# EAGLE design UsbBatteryAnalyzer (EAGLE 7.1.0)
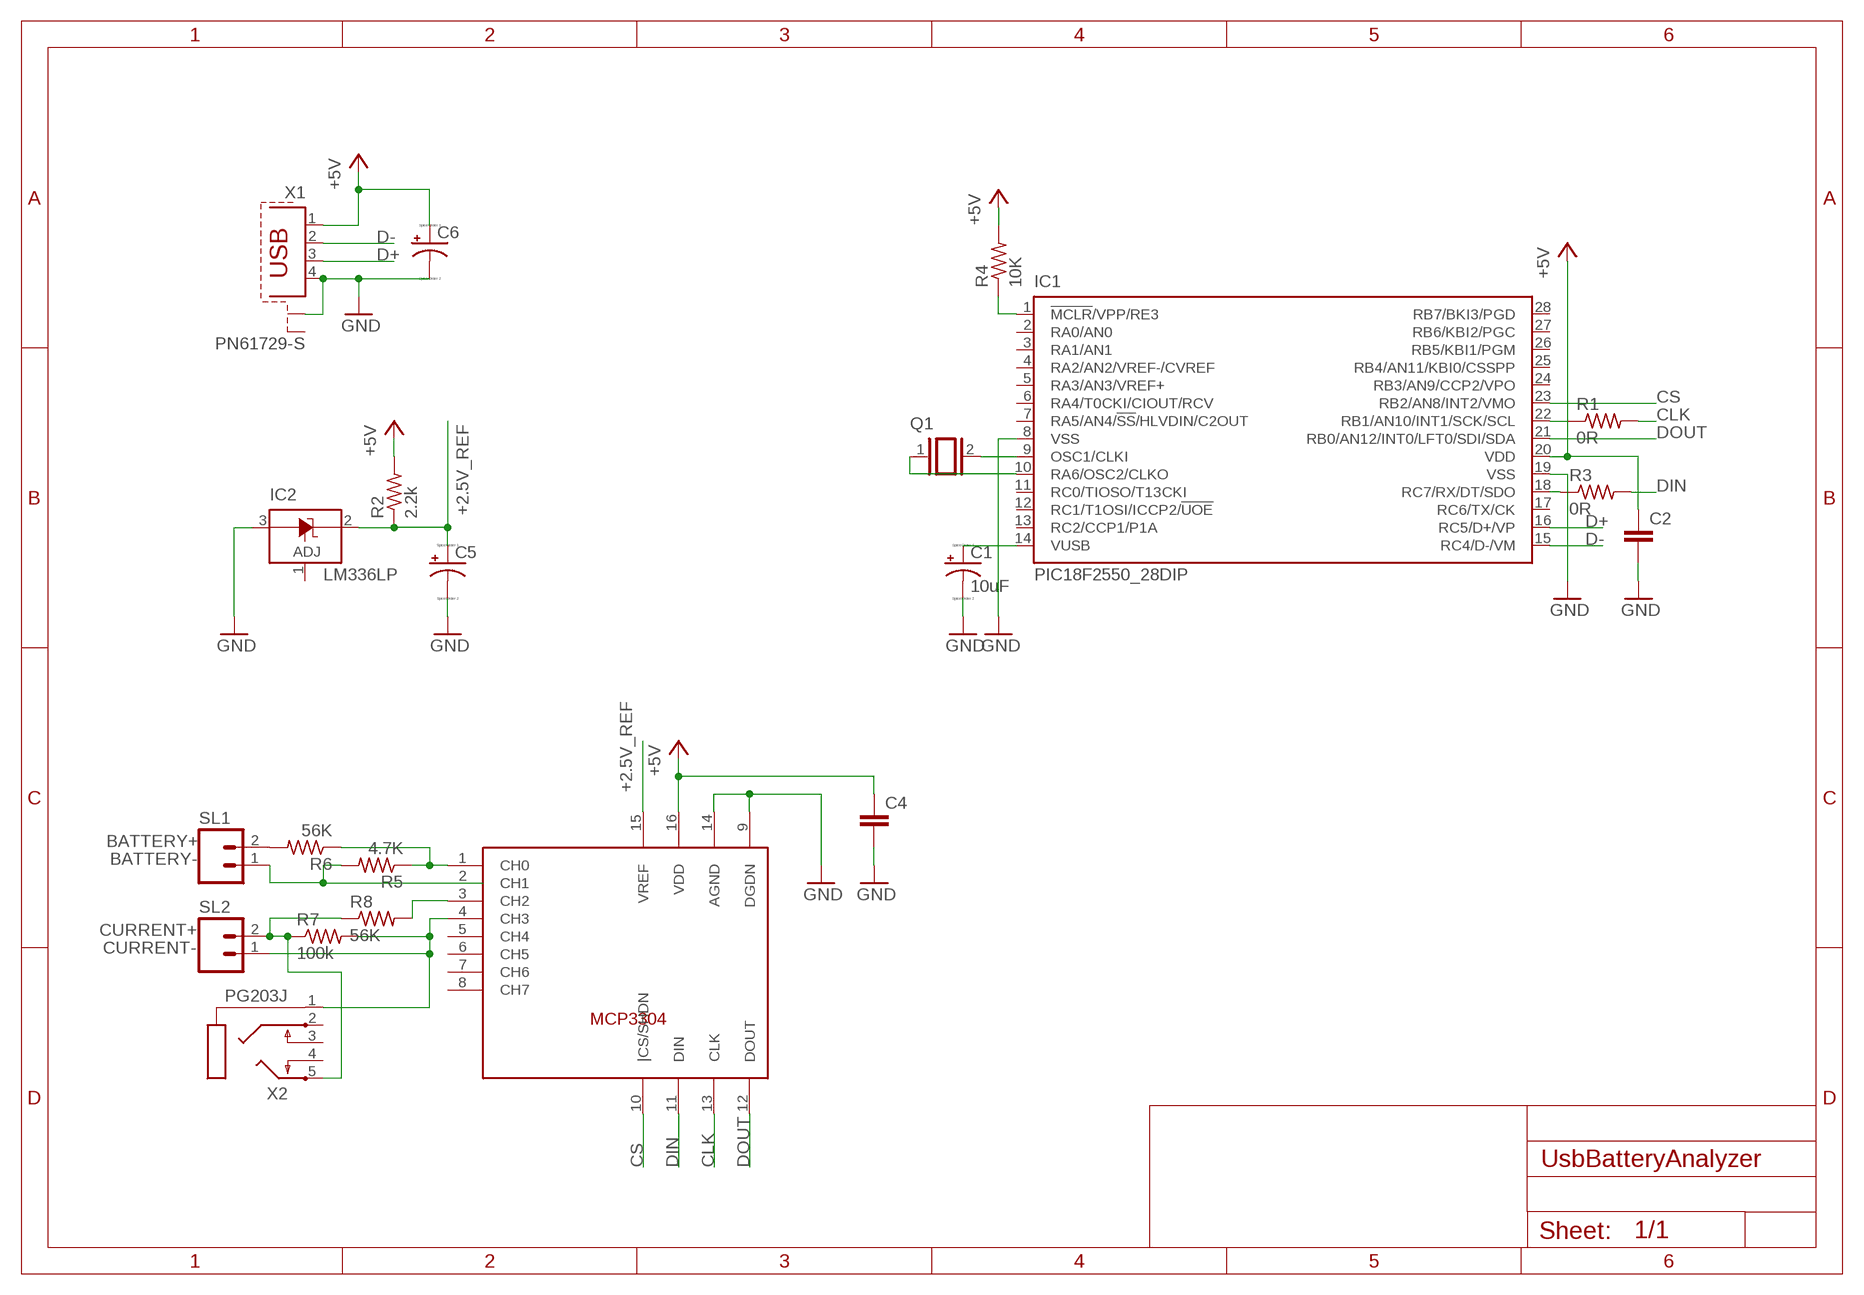
[diagram p0: schematic, sheet 1]

## Parts
C1  10uF  CPOL-USE2.5-7  [E2,5-7]
C2  C-EU050-024X044  [C050-024X044]
C4  C-EU050-024X044  [C050-024X044]
C5  CPOL-USE2.5-7  [E2,5-7]
C6  CPOL-USE2.5-7  [E2,5-7]
IC1  PIC18F2550_28DIP  [DIL28-3]
IC2  LM336LP  [TO92]
Q1  XTAL/S  [QS]
R1  0R  R-US_0207/5V  [0207/5V]
R2  2.2k  R-US_0204/7  [0204/7]
R3  0R  R-US_0207/10  [0207/10]
R4  10K  R-US_0204/7  [0204/7]
R5  4.7K  R-US_0204/7  [0204/7]
R6  56K  R-US_0204/7  [0204/7]
R7  100k  R-US_0204/7  [0204/7]
R8  56K  R-US_0204/7  [0204/7]
SL1  M02  [02P]
SL2  M02  [02P]
U$1  MCP3304  [DIP16]
X1  PN61729-S  [PN61729-S]
X2  PG203J  [PG203J]

## Nets
+2.5V_REF: C5.+ IC2.2(C) R2.1 U$1.15(VREF)
+5V: C2.1 C4.1 C6.+ IC1.20(VDD) R2.2 R4.2 U$1.16(VDD) X1.1
BATTERY+: R6.2 SL1.2
BATTERY-: R5.2 SL1.1 U$1.2(CH1)
CLK: R1.2 U$1.13(CLK)
CS: IC1.23(RB2/AN8/INT2/VMO) U$1.10(|CS/SHDN)
CURRENT+: R7.1 R8.1 SL2.2 X2.5
CURRENT-: R7.2 SL2.1 U$1.4(CH3) X2.1
D+: IC1.16(RC5/D+/VP) X1.3
D-: IC1.15(RC4/D-/VM) X1.2
DIN: R3.2 U$1.11(DIN)
DOUT: IC1.21(RB0/AN12/INT0/LFT0/SDI/SDA) U$1.12(DOUT)
GND: C1.- C2.2 C4.2 C5.- C6.- IC1.8(VSS) IC1.19(VSS) IC2.3(A) U$1.9(DGDN) U$1.14(AGND) X1.4 X1.S1
N$1: IC1.9(OSC1/CLKI) Q1.2
N$2: R5.1 R6.1 U$1.1(CH0)
N$3: IC1.10(RA6/OSC2/CLKO) Q1.1
N$4: C1.+ IC1.14(VUSB)
N$5: R8.2 U$1.3(CH2)
N$6: IC1.1(!MCLR!/VPP/RE3) R4.1
N$7: IC1.22(RB1/AN10/INT1/SCK/SCL) R1.1
N$8: IC1.18(RC7/RX/DT/SDO) R3.1
Unconnected: IC1.2(RA0/AN0) IC1.3(RA1/AN1) IC1.4(RA2/AN2/VREF-/CVREF) IC1.5(RA3/AN3/VREF+) IC1.6(RA4/T0CKI/CIOUT/RCV) IC1.7(RA5/AN4/!SS!/HLVDIN/C2OUT) IC1.11(RC0/TIOSO/T13CKI) IC1.12(RC1/T1OSI/ICCP2/!UOE) IC1.13(RC2/CCP1/P1A) IC1.17(RC6/TX/CK) IC1.24(RB3/AN9/CCP2/VPO) IC1.25(RB4/AN11/KBI0/CSSPP) IC1.26(RB5/KBI1/PGM) IC1.27(RB6/KBI2/PGC) IC1.28(RB7/BKI3/PGD) IC2.1(ADJ) U$1.5(CH4) U$1.6(CH5) U$1.7(CH6) U$1.8(CH7) X1.S2 X2.2 X2.3 X2.4

## Library data of the parts
C1 C5 C6 = resistor:CPOL-US: POLARIZED CAPACITOR, American symbol
C2 C4 = rcl:C-EU: CAPACITOR, European symbol
IC1 = microchip:PIC18F2*_28: USB Microcontrollers with nanoWatt Technology High-Performance, Enhanced Flash, 28/40/44-Pin, Source: http://ww1.microchip.com/downloads/en/devicedoc/39632c.pdf; MF: MICROCHIP; MPN: PIC18F2550-I/SP; OC_FARNELL: 1523822; OC_NEWARK: 80K6054
IC2 = linear:LM336: 2.5-V INTEGRATED REFERENCE CIRCUITS LM236 Source: http://focus.ti.com/lit/ds/symlink/lm336-2.5.pdf
Q1 = special:XTAL/S: CRYSTAL
R1-R5 R7 R8 = rcl:R-US_: RESISTOR, American symbol
R6 = resistor:R-US_: RESISTOR, American symbol
SL1 SL2 = con-amp-quick:M02: AMP QUICK CONNECTOR; OC_FARNELL: unknown; OC_NEWARK: unknown
U$1 = mcp3304:MCP3304: 8 channel ADC converter with SPI interface
X1 = con-berg:PN61729-S: BERG USB connector; OC_FARNELL: unknown; OC_NEWARK: unknown
X2 = con-hirschmann:PG203J: MIC/HEADPHONE JACK KS-S stereo microphone/headphone jack PG203JN (Schukat); OC_FARNELL: unknown; OC_NEWARK: unknown

## Board
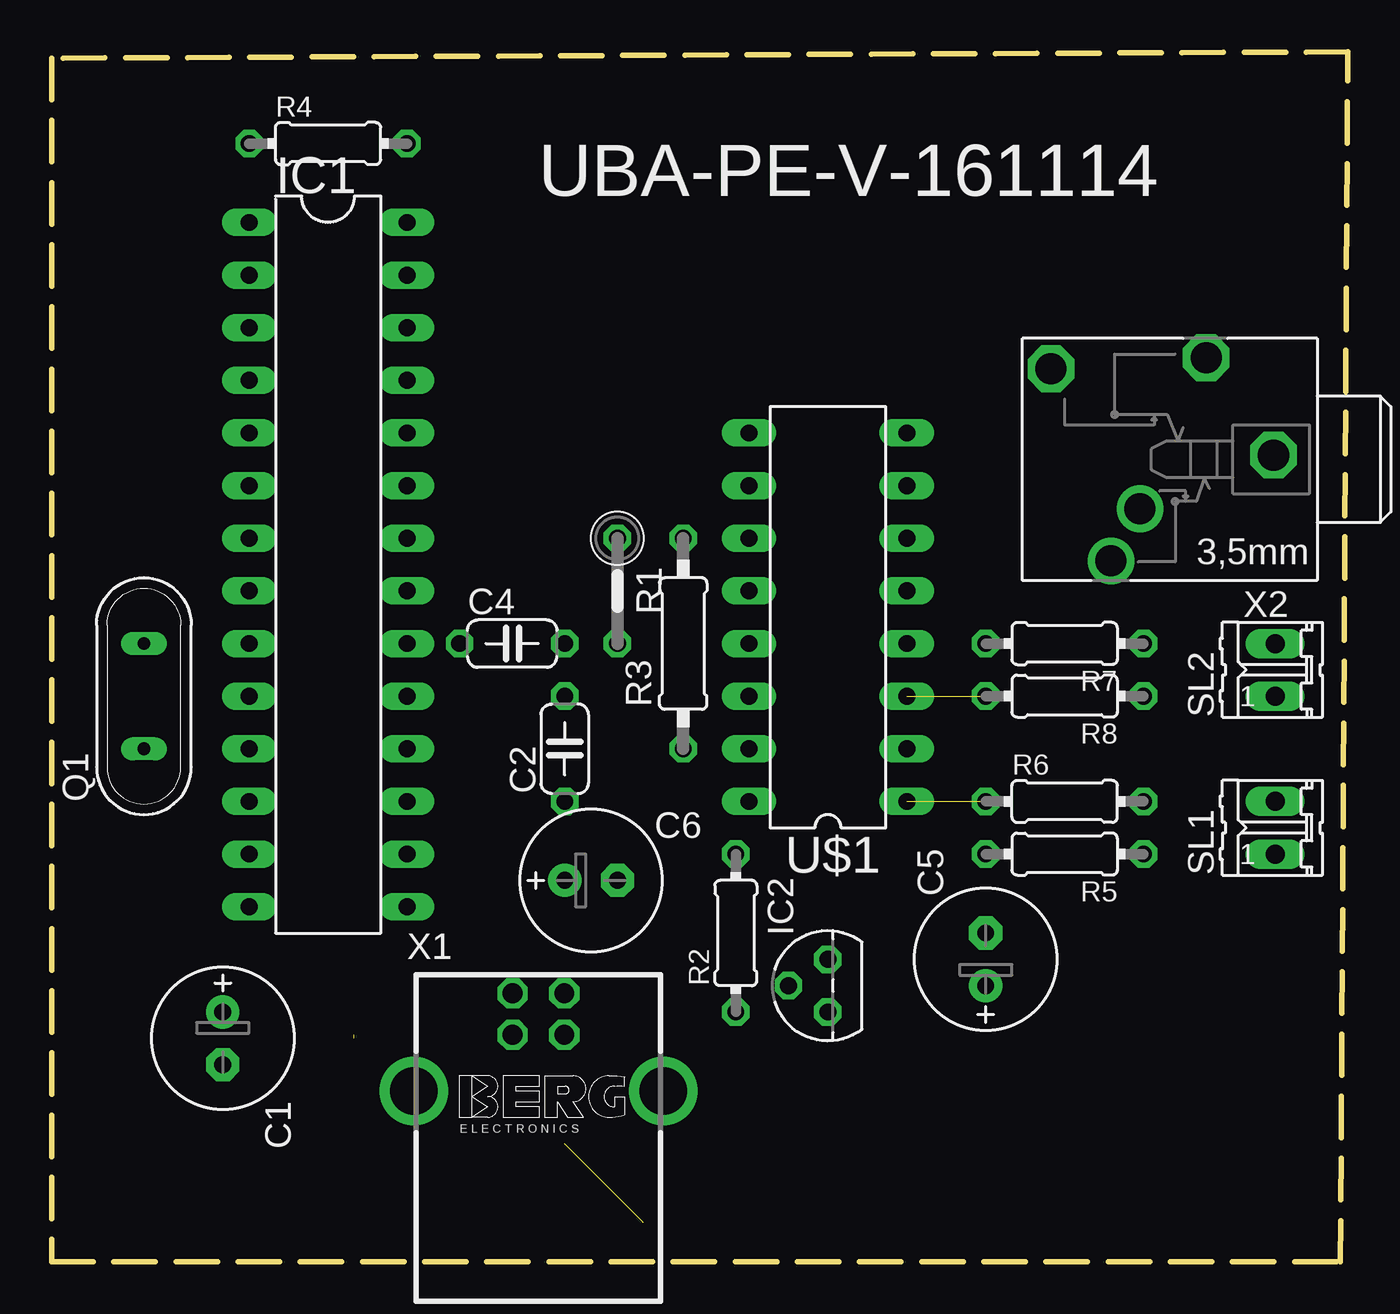
[diagram p1: board, top side]
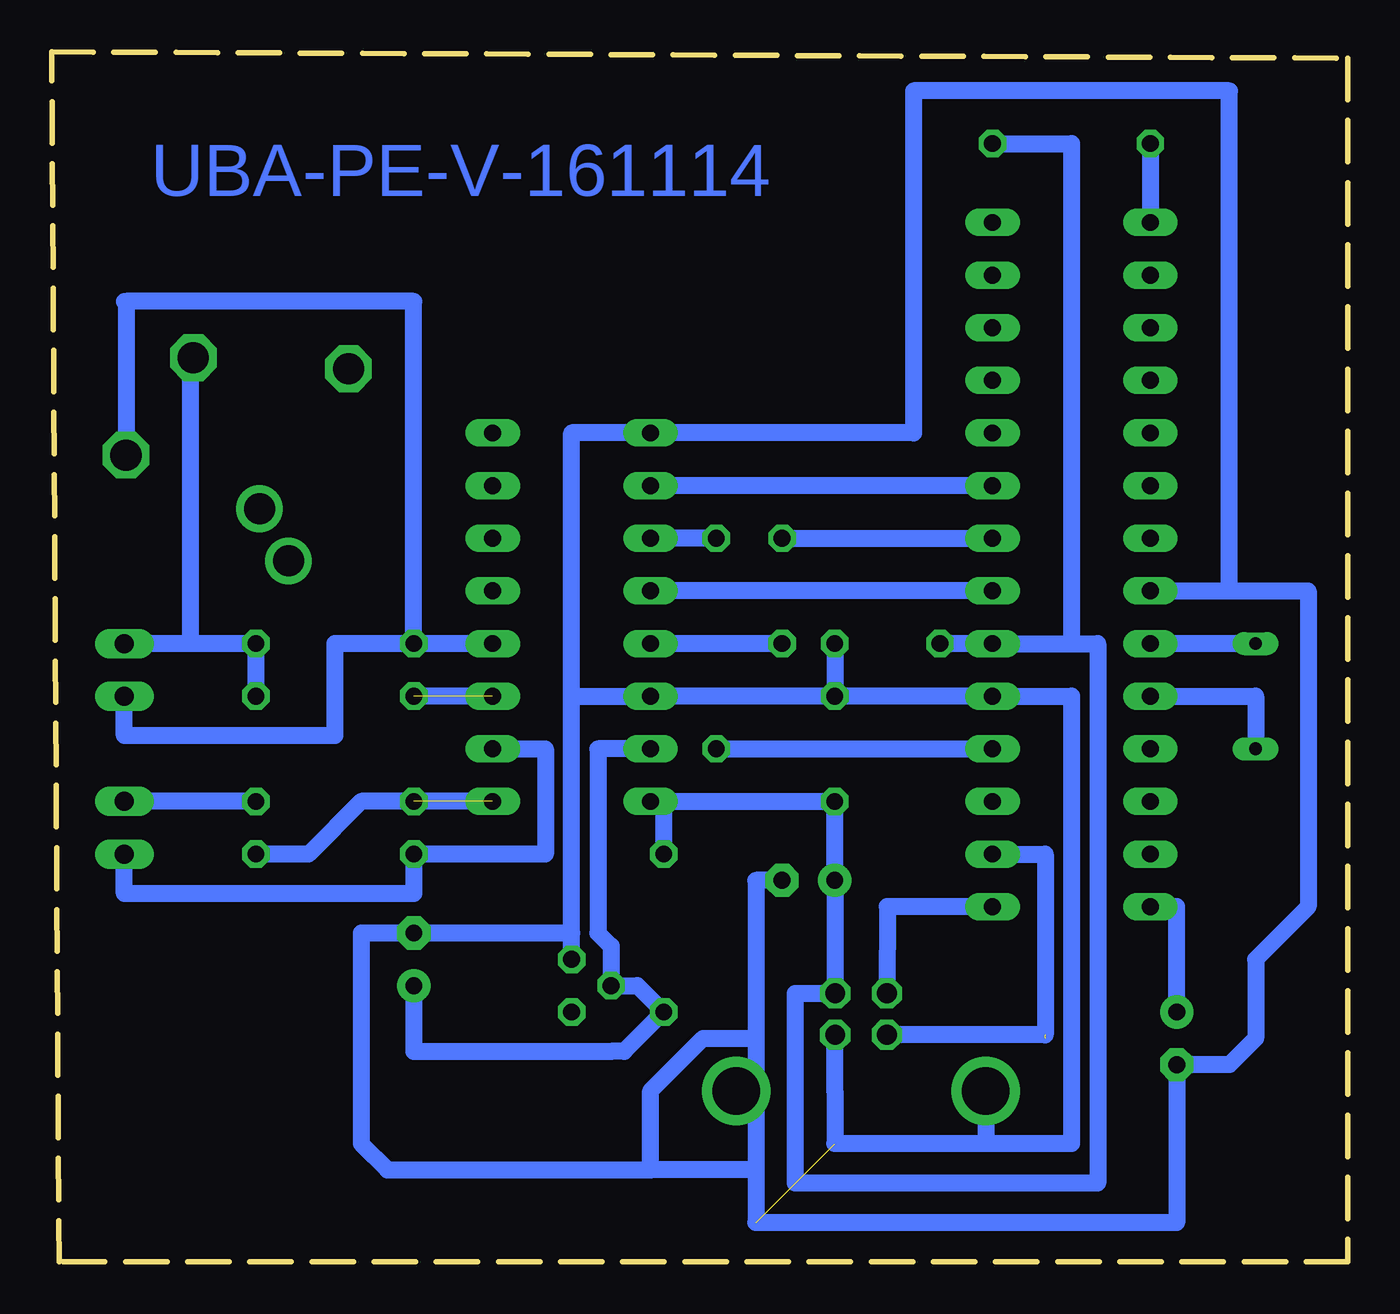
[diagram p2: board, bottom side, seen from below]

Size 62.56 x 58.4 mm. Coordinates in mm from the lower left corner, seen from the top.
Outline: 0,0 62.21,0 62.56,58.4 0,58.09 0,0
Copper layers (1*16): Top 0.035mm / dielectric 1.5mm / Bottom 0.035mm
Design rules "default *": minimum track width 20mil, minimum drill 24mil, track to track 8mil, track to pad 8mil, pad to pad 8mil, via to via 8mil, smd to smd 8mil, copper to edge 40mil, drill to drill 8mil, minimum pad ring 10mil, minimum via ring 8mil, stop-mask expansion 1mil, vias tented up to drill 0mil, thermal gap 10mil

### Footprints (pad centres in the part's own frame; a part is rotated, then mirrored left to right if it is on the bottom)
E2,5-7 = drill 0.813 pad 1.6: + -1.27,0 | drill 0.813 pad 1.6 octagon: - 1.27,0
C050-024X044 = drill 0.813 octagon: 1 -2.54,0; 2 2.54,0
DIL28-3 = drill 0.813 long: 1 -16.51,-3.81; 2 -13.97,-3.81; 3 -11.43,-3.81; 4 -8.89,-3.81; 5 -6.35,-3.81; 6 -3.81,-3.81; 7 -1.27,-3.81; 8 1.27,-3.81; 9 3.81,-3.81; 10 6.35,-3.81; 11 8.89,-3.81; 12 11.43,-3.81; 13 13.97,-3.81; 14 16.51,-3.81; 15 16.51,3.81; 16 13.97,3.81; 17 11.43,3.81; 18 8.89,3.81; 19 6.35,3.81; 20 3.81,3.81; 21 1.27,3.81; 22 -1.27,3.81; 23 -3.81,3.81; 24 -6.35,3.81; 25 -8.89,3.81; 26 -11.43,3.81; 27 -13.97,3.81; 28 -16.51,3.81
TO92 = drill 0.813 octagon: 1 -1.27,0; 2 0,1.905; 3 1.27,0
QS = drill 0.61 long: 1 -2.54,0; 2 2.54,0
0207/5V = drill 0.813 octagon: 1 -2.54,0; 2 2.54,0
0204/7 = drill 0.813 octagon: 1 -3.81,0; 2 3.81,0
0207/10 = drill 0.813 octagon: 1 -5.08,0; 2 5.08,0
02P = drill 0.914 long: 1 -1.27,0; 2 1.27,0
DIP16 = drill 0.813 long: 1 -7.62,-3.81; 2 -5.08,-3.81; 3 -2.54,-3.81; 4 0,-3.81; 5 2.54,-3.81; 6 5.08,-3.81; 7 7.62,-3.81; 8 10.16,-3.81; 9 10.16,3.81; 10 7.62,3.81; 11 5.08,3.81; 12 2.54,3.81; 13 0,3.81; 14 -2.54,3.81; 15 -5.08,3.81; 16 -7.62,3.81
PN61729-S = drill 0.95 octagon: 1 1.25,4.71; 2 -1.25,4.71; 3 -1.25,2.71; 4 1.25,2.71 | drill 2.3 pad 2.9: S1 -6.02,0; S2 6.02,0
PG203J = drill 1.499 octagon: 1 -5.004,-0.203; 4 5.74,-4.369; 5 -1.753,-4.902 | drill 1.499: 2 2.845,4.902; 3 1.448,2.388

### Placement (x,y rotation side)
C1  8.25,10.79 270 top
C2  24.77,24.76 90 top
C4  22.22,29.85 0 top
C5  45.08,14.61 90 top
C6  26.03,18.42 0 top
IC1  13.33,33.66 270 top
IC2  37.47,13.34 90 top
Q1  4.44,27.3 90 top
R1  27.3,32.39 270 top
R2  33.02,15.88 90 top
R3  30.48,29.85 90 top
R4  13.33,53.97 0 top
R5  48.89,19.68 180 top
R6  48.89,22.22 0 top
R7  48.89,29.85 180 top
R8  48.89,27.3 180 top
SL1  59.05,20.96 90 top
SL2  59.05,28.57 90 top
U$1  37.47,29.85 90 top
X1  23.49,8.25 0 top
X2  53.97,38.73 180 top

### Tracks (layer width: path | path; a pad name or v marks a point on that pad's centre or on a via)
+2.5V_REF
  Bottom 0.813: U$1.15 36.19,24.76 36.19,15.88 35.56,15.24 IC2.2 34.29,13.34 R2.1 34.92,10.16 35.56,10.16 36.19,10.16 45.08,10.16 C5.+
+5V
  Bottom 0.813: R2.2 33.02,22.22 U$1.16 C2.1 C6.+ 24.77,12.96 | C4.1 IC1.20 13.33,29.85 | 13.33,29.85 12.06,29.85 12.06,3.81 26.67,3.81 26.67,12.96 24.77,12.96 | 24.77,12.96 X1.1 | R4.2 13.33,53.97 13.33,29.85
BATTERY+
  Bottom 0.813: R6.2 SL1.2
BATTERY-
  Bottom 0.813: U$1.2 38.73,24.76 38.73,19.68 R5.2 45.08,17.78 59.05,17.78 SL1.1
CLK
  Bottom 0.813: R1.2 U$1.13
CS
  Bottom 0.813: IC1.23 U$1.10
CURRENT+
  Bottom 0.813: R8.1 R7.1 55.88,29.85 | 55.88,29.85 SL2.2 | X2.5 55.88,43.64 55.88,29.85
CURRENT-
  Bottom 0.813: R7.2 48.89,29.85 48.89,25.4 59.05,25.4 SL2.1 | U$1.4 R7.2 | R7.2 45.08,46.36 58.98,46.36 | 59.05,46.36 58.98,46.36 | 58.98,46.36 X2.1
D+  (1 unrouted)
  Bottom 0.813: IC1.16 14.61,19.68 14.61,10.96 X1.3
D-
  Bottom 0.813: IC1.15 22.22,17.14 X1.2
DIN
  Bottom 0.813: R3.2 U$1.11
DOUT
  Bottom 0.813: IC1.21 U$1.12
GND  (1 unrouted)
  Bottom 0.813: 37.47,27.3 IC2.3 37.47,15.88 C5.- 47.62,15.88 47.62,5.71 46.36,4.45 33.66,4.45 | 37.47,27.3 U$1.14 C2.2 | 37.47,27.3 37.47,40 U$1.9 20.95,40 20.95,56.52 5.72,56.52 5.72,32.39 | C2.2 IC1.19 13.33,27.3 13.33,5.71 17.47,5.71 | C4.2 C2.2 | X1.4 24.77,8.25 24.77,5.71 17.47,5.71 | X1.S1 17.47,5.71 | C6.- 28.58,18.42 28.58,10.79 | 28.58,10.79 28.58,4.45 | 28.58,4.45 28.58,1.91 8.25,1.91 C1.- 5.72,9.52 4.44,10.79 4.44,14.61 1.9,17.14 1.9,32.39 5.72,32.39 | IC1.8 5.72,32.39 | 33.66,4.45 33.66,8.25 31.11,10.79 28.58,10.79 | 28.58,4.45 33.66,4.45
N$1
  Bottom 0.813: Q1.2 IC1.9
N$2  (1 unrouted)
  Bottom 0.813: R5.1 50.16,19.68 47.62,22.22 R6.1 U$1.1
N$3
  Bottom 0.813: Q1.1 4.44,27.3 IC1.10
N$4
  Bottom 0.813: C1.+ 8.25,17.14 IC1.14
N$5  (1 unrouted)
  Bottom 0.813: U$1.3 R8.2
N$6
  Bottom 0.813: R4.1 IC1.1
N$7
  Bottom 0.813: R1.1 IC1.22
N$8
  Bottom 0.813: R3.1 IC1.18

### Text on the board
Bottom: UBA-PE-V-161114
tNames: UBA-PE-V-161114